# Altium project npt_client_wifi_board.PrjPcb
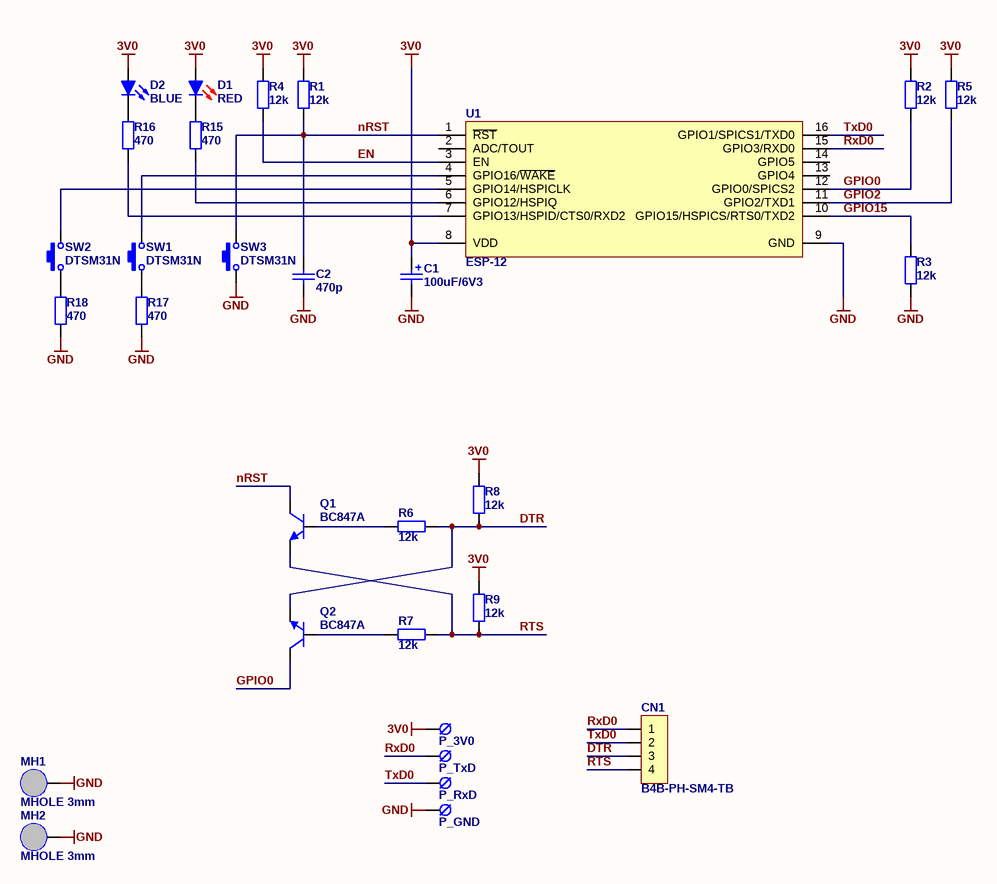
[diagram p0: npt_client_wifi_board.SchDoc]
1 sheet, 30 parts. Net scope: global (net labels, ports and power ports of the same name join across sheets).
Board file: npt_client_wifi_board.PcbDoc

## Sheet npt_client_wifi_board.SchDoc
size A4; Projectnumber: OWN-000; Size: A4

### Parts
C1  100uF/6V3  [SMDB]
C2  470p  [C0805]
CN1  B4B-PH-SM4-TB  [B4B-PH-SM4-TB]
D1  RED  [LED0805R]
D2  BLUE  [LED0805B]
MH1  MHOLE 3mm  [3mm screw drill I]  (no BOM)
MH2  MHOLE 3mm  [3mm screw drill I]  (no BOM)
P_3V0  CablePAD  [PADSMD2x3mm]  (value not drawn)  (no BOM)
P_GND  CablePAD  [PADSMD2x3mm]  (value not drawn)  (no BOM)
P_RxD  CablePAD  [PADSMD2x3mm]  (value not drawn)  (no BOM)
P_TxD  CablePAD  [PADSMD2x3mm]  (value not drawn)  (no BOM)
Q1  BC847A  [SOT-23]
Q2  BC847A  [SOT-23]
R1  12k  [R0805]
R2  12k  [R0805]
R3  12k  [R0805]
R4  12k  [R0805]
R5  12k  [R0805]
R6  12k  [R0805]
R7  12k  [R0805]
R8  12k  [R0805]
R9  12k  [R0805]
R15  470  [R0805]
R16  470  [R0805]
R17  470  [R0805]
R18  470  [R0805]
SW1  DTSM31N  [DTSM-3]
SW2  DTSM31N  [DTSM-3]
SW3  DTSM31N  [DTSM-3]
U1  ESP-12  [ESP-12]

### Nets
3V0: C1.1 D1.1(A) D2.1(A) P_3V0.0 R1.1 R2.1 R4.1 R5.1 R8.2 R9.2 U1.8(VDD)
GND: C1.2 C2.1 MH1.1(GND) MH2.1(GND) P_GND.0 R3.2 R17.2 R18.2 SW3.1 U1.9(GND)
DTR: CN1.3 Q2.2(E) R6.1 R8.1
EN: R4.2 U1.3(EN)
GPIO0: Q2.3(C) R2.2 U1.12(GPIO0/SPICS2)
GPIO2: R5.2 U1.11(GPIO2/TXD1)
GPIO15: R3.1 U1.10(GPIO15/HSPICS/RTS0/TXD2)
nRST: C2.2 Q1.3(C) R1.2 SW3.2 U1.1(~{RST})
RTS: CN1.4 Q1.2(E) R7.1 R9.1
RxD0: CN1.1 P_TxD.0 U1.15(GPIO3/RXD0)
TxD0: CN1.2 P_RxD.0 U1.16(GPIO1/SPICS1/TXD0)
NetD1_2: D1.2(K) R15.1
NetD2_2: D2.2(K) R16.1
NetQ1_1: Q1.1(B) R6.2
NetQ2_1: Q2.1(B) R7.2
NetR15_2: R15.2 U1.6(GPIO12/HSPIQ)
NetR16_2: R16.2 U1.7(GPIO13/HSPID/CTS0/RXD2)
NetR17_1: R17.1 SW1.1
NetR18_1: R18.1 SW2.1
NetSW1_2: SW1.2 U1.4(GPIO16/~{WAKE})
NetSW2_2: SW2.2 U1.5(GPIO14/HSPICLK)

Not connected (* = marked no-connect by the designer): U1 2(ADC/TOUT) 13(GPIO4) 14(GPIO5)

### Notes on the sheet
- PROJECT NAME:
- PROJECT NO.:
- DATE:
- TITLE:
- SHEET
- of
- DRAWN BY:
- REVISION:
- FILENAME:
- A4

### Library data of the parts
C1 = Cap Pol Tant: Polarized Tantalum Capacitor; ComponentLink1Description: datasheet; ComponentLink2Description: supplier; Value: 100uF/6V3
C2 = Cap: Capacitor; ComponentLink1Description: datasheet; ComponentLink2Description: supplier; Value: 470p
D1 = LED_RED: RED LED; Published: 04-Apr-2006
D2 = LED_BLUE: BLUE LED; Published: 04-Apr-2006
MH1 MH2 = MHOLE_3MM: 3mm Mounting Hole
P_3V0 P_GND P_RxD P_TxD = CablePAD: Cable PAD; Published: 14-Sep-2006
Q1 Q2 = BC847A: NPN General Purpose Transistor (VCE=45V, IC=100mA, HFE=110-220); PowerRating: 250mW; VCEO: 45V; IC: 100mA; Supplier 1: TME; Supplier 2: Farnell; Supplier 3: Farnell; Supplier 4: Farnell; Supplier 5: Farnell; Supplier Part Number 1: BC847A-DIO; Supplier Part Number 2: 1081231; Supplier Part Number 3: 1081231RL; Supplier Part Number 4: 1459037RL; Supplier Part Number 5: 1459037; HFE: 110-220
R1-R9 R15-R18 = Res: Resistor; Published: 19-Feb-2006; ComponentLink1Description: datasheet; ComponentLink2Description: supplier
  R1-R9: Value: 12k
  R15-R18: Value: 470
SW1-SW3 = DTSM31N: DIPTRONICS 6x3,5mm SMD Tactile SPST-NO Switch
U1 = ESP-12: ESP-12 Wi-Fi Module by AI-Thinker